# Altium project do_an.PrjPCB
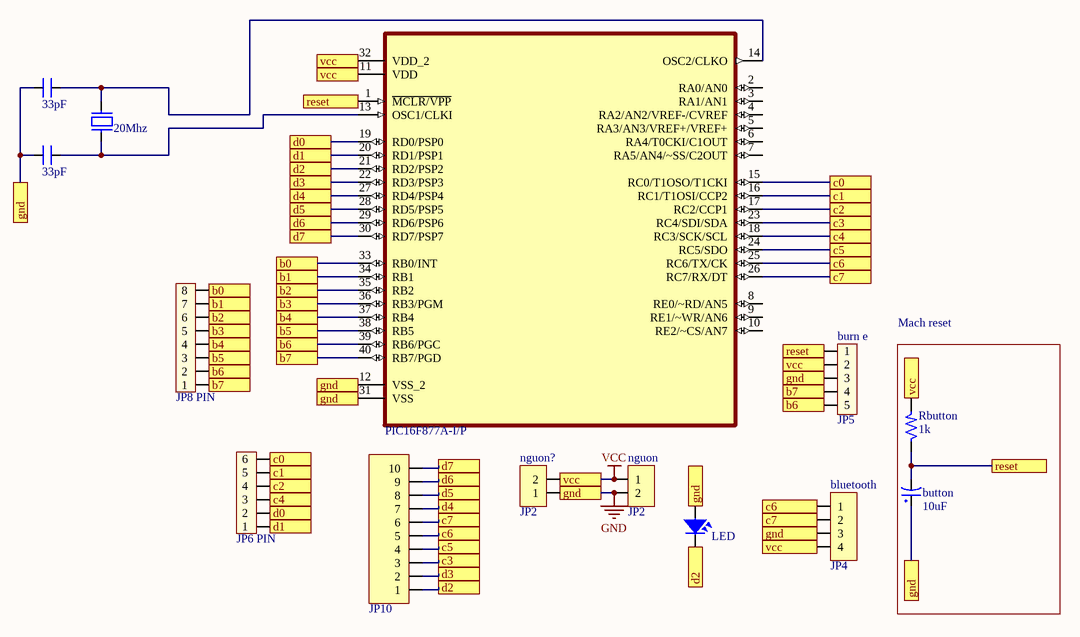
[diagram p0: Sheet1.SchDoc]
1 sheet, 14 parts. Net scope: flat (ports and power ports of the same name join across sheets).
Board file: PCB1.PcbDoc

## Sheet Sheet1.SchDoc
size A

### Parts
(Parts that share a designator on the sheet are numbered #1, #2 ... from top to bottom, then left to right.)
b  JP8 PIN  [JP8]
bluetooth  JP4  [JP4-C1T]
burn_e  JP5  [JP5]
button  10uF  [CP1/2]
C?#1  33pF  [SM-0805]
C?#2  33pF  [SM-0805]
C?#3  JP10  [JP10-C1T]
crystal?  20Mhz  [XT2]
JP?  JP6 PIN  [JP6]
LED?  LED  [LED-3]
nguon  JP2  [JP2-C1T]
nguon?  JP2  [JP2-C1T]
Rbutton  1k  [SM-1206]
  PIC16F877A-I/P  [DIP254P1524X483-40]

### Sub-sheets
Mach reset = File Name (file not in this document): no entries

### Ports
b0, b1, b2, b3, b4, b5, b6, b7, c0, c1, c2, c3, c4, c5, c6, c7, d0, d1, d2, d3, d4, d5, d6, d7, gnd, reset, vcc

### Nets
GND: bluetooth.3 burn_e.3 button.1 C?#1.1 C?#2.1 LED?.1 nguon.2 nguon?.1 .12(VSS_2) .31(VSS) ; port gnd
VCC: bluetooth.4 burn_e.2 nguon.1 nguon?.2 Rbutton.2 .11(VDD) .32(VDD_2) ; port vcc
Netb_1: b.1 burn_e.4 .40(RB7/PGD) ; port b7
Netb_2: b.2 burn_e.5 .39(RB6/PGC) ; port b6
Netb_3: b.3 .38(RB5) ; port b5
Netb_4: b.4 .37(RB4) ; port b4
Netb_5: b.5 .36(RB3/PGM) ; port b3
Netb_6: b.6 .35(RB2) ; port b2
Netb_7: b.7 .34(RB1) ; port b1
Netb_8: b.8 .33(RB0/INT) ; port b0
Netbluetooth_1: bluetooth.1 C?#3.5 .25(RC6/TX/CK) ; port c6
Netbluetooth_2: bluetooth.2 C?#3.6 .26(RC7/RX/DT) ; port c7
Netburn_e_1: burn_e.1 button.2 Rbutton.1 .1(~{MCLR/VPP}) ; port reset
NetC?#1_2: C?#1.2 crystal?.2 .14(OSC2/CLKO)
NetC?#2_2: C?#2.2 crystal?.1 .13(OSC1/CLKI)
NetC?#3_1: C?#3.1 LED?.2 .21(RD2/PSP2) ; port d2
NetC?#3_2: C?#3.2 .22(RD3/PSP3) ; port d3
NetC?#3_3: C?#3.3 .23(RC4/SDI/SDA) ; port c3
NetC?#3_4: C?#3.4 .24(RC5/SDO) ; port c5
NetC?#3_7: C?#3.7 .27(RD4/PSP4) ; port d4
NetC?#3_8: C?#3.8 .28(RD5/PSP5) ; port d5
NetC?#3_9: C?#3.9 .29(RD6/PSP6) ; port d6
NetC?#3_10: C?#3.10 .30(RD7/PSP7) ; port d7
NetJP?_1: JP?.1 .20(RD1/PSP1) ; port d1
NetJP?_2: JP?.2 .19(RD0/PSP0) ; port d0
NetJP?_3: JP?.3 .18(RC3/SCK/SCL) ; port c4
NetJP?_4: JP?.4 .17(RC2/CCP1) ; port c2
NetJP?_5: JP?.5 .16(RC1/T1OSI/CCP2) ; port c1
NetJP?_6: JP?.6 .15(RC0/T1OSO/T1CKI) ; port c0

Not connected (* = marked no-connect by the designer):  2(RA0/AN0) 3(RA1/AN1) 4(RA2/AN2/VREF-/CVREF) 5(RA3/AN3/VREF+/VREF+) 6(RA4/T0CKI/C1OUT) 7(RA5/AN4/~SS/C2OUT) 8(RE0/~RD/AN5) 9(RE1/~WR/AN6) 10(RE2/~CS/AN7)

### Library data of the parts
b = JP8: Value: JP7
bluetooth = JP4: WR-PHD 2.54 mm Angled Socket Header; Manufacturer: W¨¹rth Elektronik eiSos GmbH; partNo: 613004143121; ComponentLink1 Description: Manufacturer; ComponentLink2 Description: Datasheet; NoPins: 04; Created Date: 29 March 2013; ComponentLink1URL: http://www.we-online.com; ComponentLink2URL: http://katalog.we-online.de/em/datasheet/6130xx143121.pdf; Created by: Karrer Zheng
button = CP1: Cap P  0,1uF < 22uF , 16 - 50V; Value: 10uF/50V; Description 1: 10 => 220uF/6,3V/10V - 10uF => 100uF/16V; Description 2: 0,1uF => 33uF/50V - 10uF => 22uF/63V; Description 3: 0,47uF => 10uF/100V
C?#1 C?#2 = CM: Cap SMD; Value: 103
C?#3 = JP10: WR-PHD 2.54 mm Angled Socket Header; Manufacturer: W¨¹rth Elektronik eiSos GmbH; partNo: 613010143121; ComponentLink1 Description: Manufacturer; ComponentLink2 Description: Datasheet; NoPins: 10; Created Date: 29 March 2013; ComponentLink1URL: http://www.we-online.com; ComponentLink2URL: http://katalog.we-online.de/em/datasheet/6130xx143121.pdf; Created by: Karrer Zheng
crystal? = XT2: Crystal For all Crystal 2pin.; Value: 4Mhz
JP? = JP6: Value: JP7
LED? = LED: LED Single colour Green and Red; Value: LED 3 ly Single Colour
nguon nguon? = JP2: WR-PHD 2.54 mm Angled Socket Header; Manufacturer: W¨¹rth Elektronik eiSos GmbH; partNo: 613002143121; ComponentLink1 Description: Manufacturer; ComponentLink2 Description: Datasheet; NoPins: 02; Created Date: 29 March 2013; ComponentLink1URL: http://www.we-online.com; ComponentLink2URL: http://katalog.we-online.de/em/datasheet/6130xx143121.pdf; Created by: Karrer Zheng
Rbutton = R: Resistor 1/4W; Value: R1/4W - 1K
 = PIC16F877A-I/P: PIC PICÂ® 16F Microcontroller IC 8-Bit 20MHz 14KB _8K x 14_ FLASH 40-PDIP; MF: Microchip